# EAGLE design SWD_PROGRAMMER_minimal (EAGLE 7.5.0)
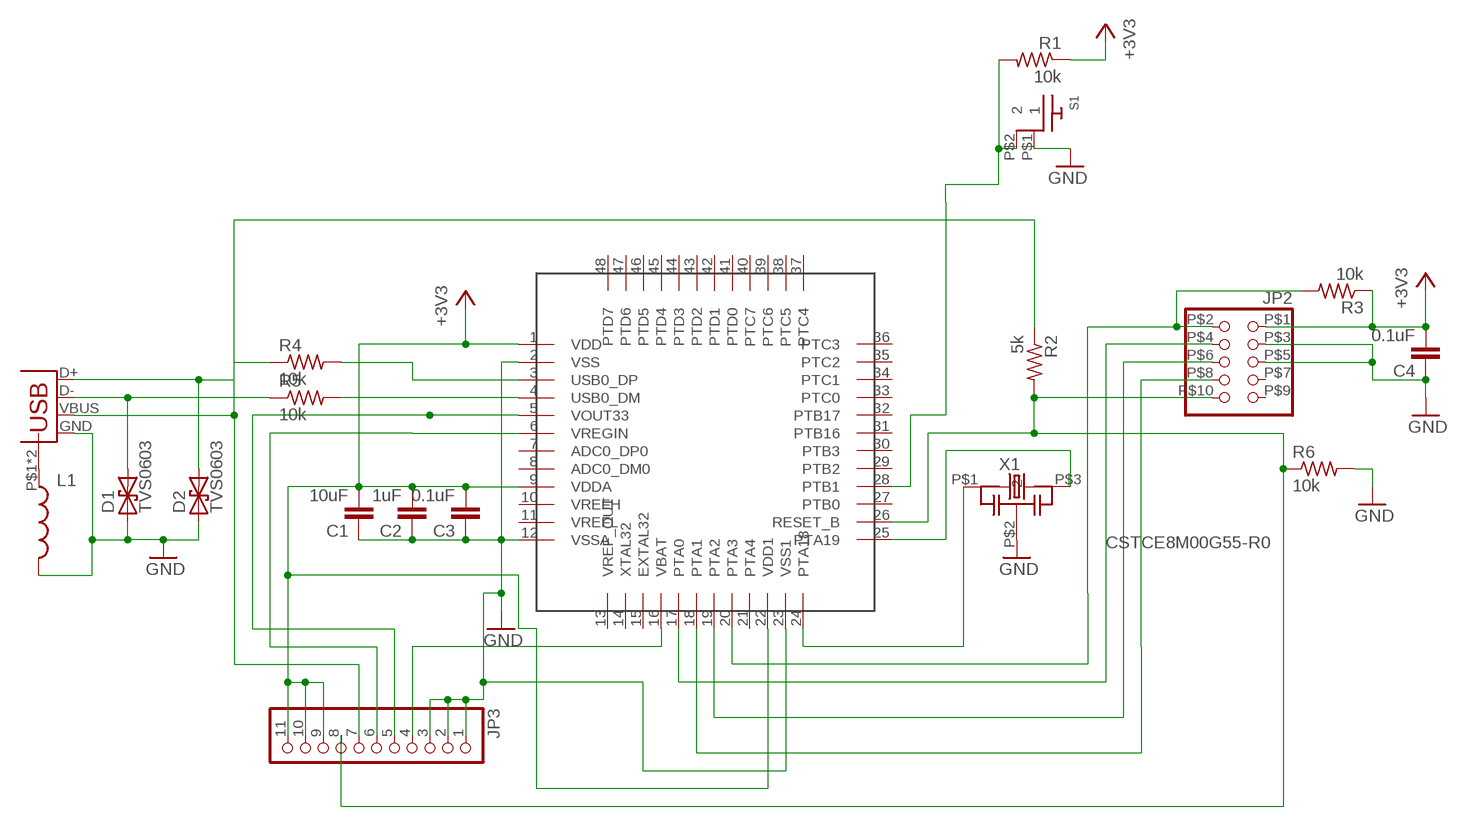
[diagram p0: schematic, sheet 1]

## Parts
C1  10uF  RF-C0805  [C0805]
C2  1uF  RF-C0805  [C0805]
C3  0.1uF  RF-C0805  [C0805]
C4  0.1uF  RF-C0805  [C0805]
D1  TVS0603  [0603-RES]
D2  TVS0603  [0603-RES]
J1  USB_B  [USB-B-PTH-VERTICAL]
JP2  PINHD-2X5SMALL  [2X5HDR]
JP3  PINHD-1X11  [1X11]
L1  INDUCTOR0603  [0603]
R1  10k  RF-R0805  [RF-C0805]
R2  5k  RF-R0805  [RF-C0805]
R3  10k  RF-R0805  [RF-C0805]
R4  10k  RF-R0805  [RF-C0805]
R5  10k  RF-R0805  [RF-C0805]
R6  10k  RF-R0805  [RF-C0805]
S1  RA_BUTTON  [RA_BUTTON]
U$1  KL20_48  [LQFP-48]
X1  CSTCE8M00G55-R0  [CSTCE_G_A]

## Nets
+3V3: C1.2 C2.2 C3.2 C4.2 JP2.P$1 JP3.9 JP3.10 JP3.11 R1.1 R3.1 U$1.1(VDD) U$1.9(VDDA) U$1.22(VDD1)
CLK: JP2.P$4 U$1.17(PTA0)
D_N [USB]: D1.2 J1.D- R5.1
D_P [USB]: D2.2 J1.D+ R4.1
GND [GND]: C1.1 C2.1 C3.1 C4.1 D1.1 D2.1 J1.GND JP2.P$3 JP2.P$5 JP3.1 JP3.2 JP3.3 L1.2 R6.2 S1.P$1 U$1.2(VSS) U$1.12(VSSA) U$1.23(VSS1) X1.P$2
JRST: JP2.P$10 JP3.8 R2.2 R6.1 U$1.26(RESET_B)
N$1: R4.2 U$1.3(USB0_DP)
N$2: J1.VBUS JP3.7 R2.1
N$3: JP3.4 U$1.16(VBAT)
N$4: U$1.24(PTA18) X1.P$1
N$5: J1.P$1(SHIELD) J1.P$2(SHIELD) L1.1
N$6: U$1.25(PTA19) X1.P$3
N$7: JP3.5 U$1.5(VOUT33)
N$8: JP3.6 U$1.6(VREGIN)
N$9: R5.2 U$1.4(USB0_DM)
RST: R1.2 S1.P$2 U$1.28(PTB1)
TDI: JP2.P$8 U$1.18(PTA1)
TDO: JP2.P$6 U$1.19(PTA2)
TMS: JP2.P$2 R3.2 U$1.20(PTA3)
Unconnected: JP2.P$7 JP2.P$9 U$1.7(ADC0_DP0) U$1.8(ADC0_DM0) U$1.10(VREFH) U$1.11(VREFL) U$1.13(VREF_OUT) U$1.14(XTAL32) U$1.15(EXTAL32) U$1.21(PTA4) U$1.27(PTB0) U$1.29(PTB2) U$1.30(PTB3) U$1.31(PTB16) U$1.32(PTB17) U$1.33(PTC0) U$1.34(PTC1) U$1.35(PTC2) U$1.36(PTC3) U$1.37(PTC4) U$1.38(PTC5) U$1.39(PTC6) U$1.40(PTC7) U$1.41(PTD0) U$1.42(PTD1) U$1.43(PTD2) U$1.44(PTD3) U$1.45(PTD4) U$1.46(PTD5) U$1.47(PTD6) U$1.48(PTD7)

## Library data of the parts
C1 = GW-devices:RF-C: RF capacitor pads for FSL reference design; MFGN: Murata; MFGP: GRM219R61E106KA12D
C2 = GW-devices:RF-C: RF capacitor pads for FSL reference design; MFGN: TDK; MFGP: C2012X5R1E105K125AA
C3 C4 = GW-devices:RF-C: RF capacitor pads for FSL reference design; MFGN: TDK; MFGP: C2012X5R1H104K085AA
D1 D2 = SparkFun:TVS; MFGN: Eaton Bussman; MFGP: 0603ESDA2-TR2
J1 = KW2:USB_B; MFGN: Harwin; MFGP: M701-330442
JP2 = KW2:PINHD-2X5: PIN HEADER; MFGN: Sullins Connector Solutions; MFGP: GRPB052VWVN-RC
JP3 = pinhead:PINHD-1X11: PIN HEADER
L1 = SparkFun:INDUCTOR: Inductors Basic Inductor/Choke - 0603 and 1206. Footprints are not proven and vary greatly between part numbers.; MFGN: TDK; MFGP: MPZ1608S331ATA00
R1-R6 = GW-devices:RF-R: RF resistor pads for FSL reference design; MFGN: Vishay Dale; MFGP: CRCW080510K0FKEA
S1 = KW2:RA_BUTTON
U$1 = KW2:KL20_48
X1 = KW2:CSTCE8M00G55-R0

## Net classes
1 USB: width 0.6 mm, clearance 0.2 mm

## Board
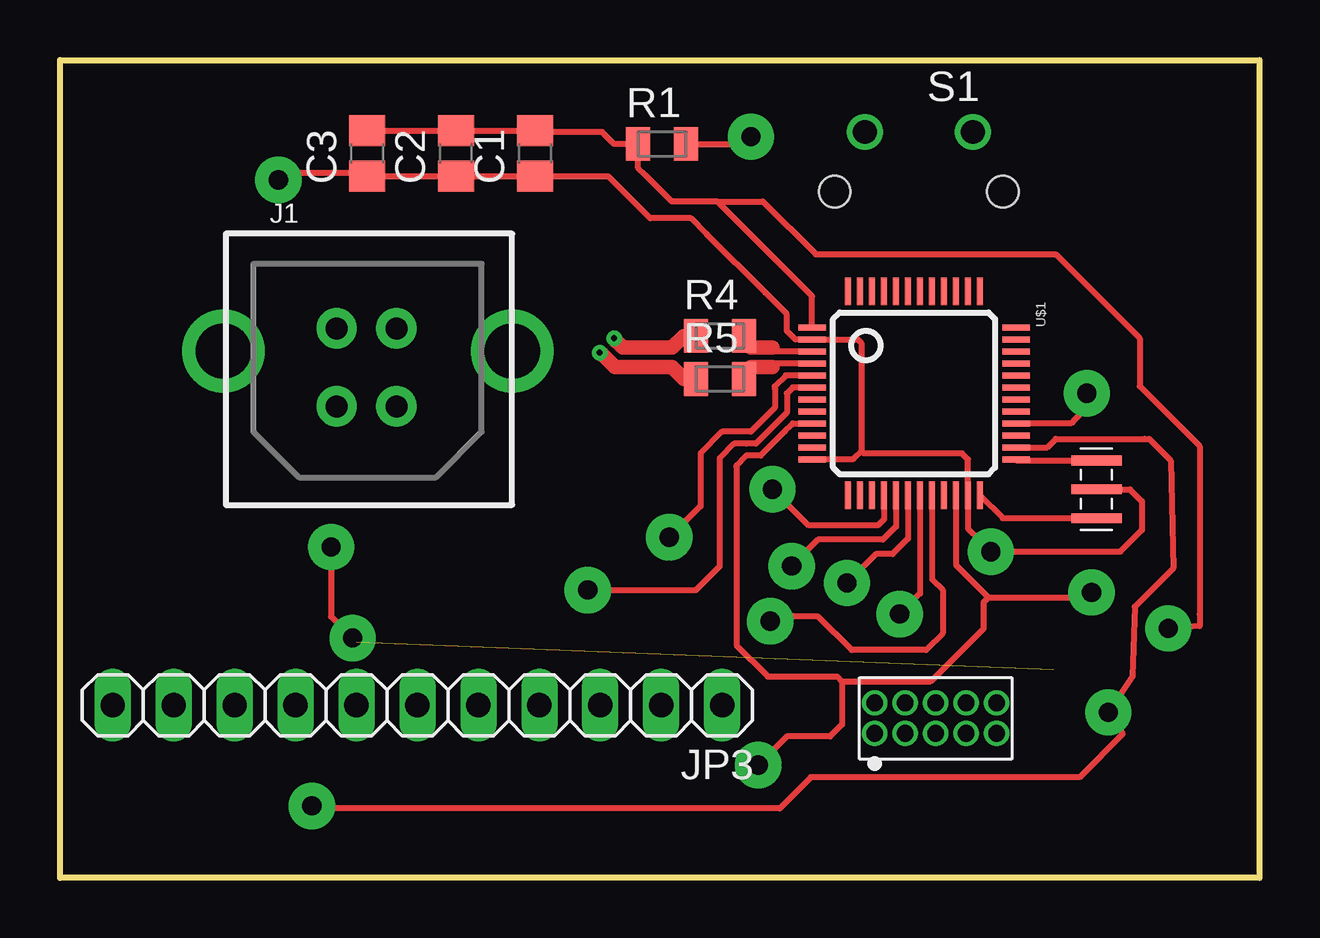
[diagram p1: board, top side]
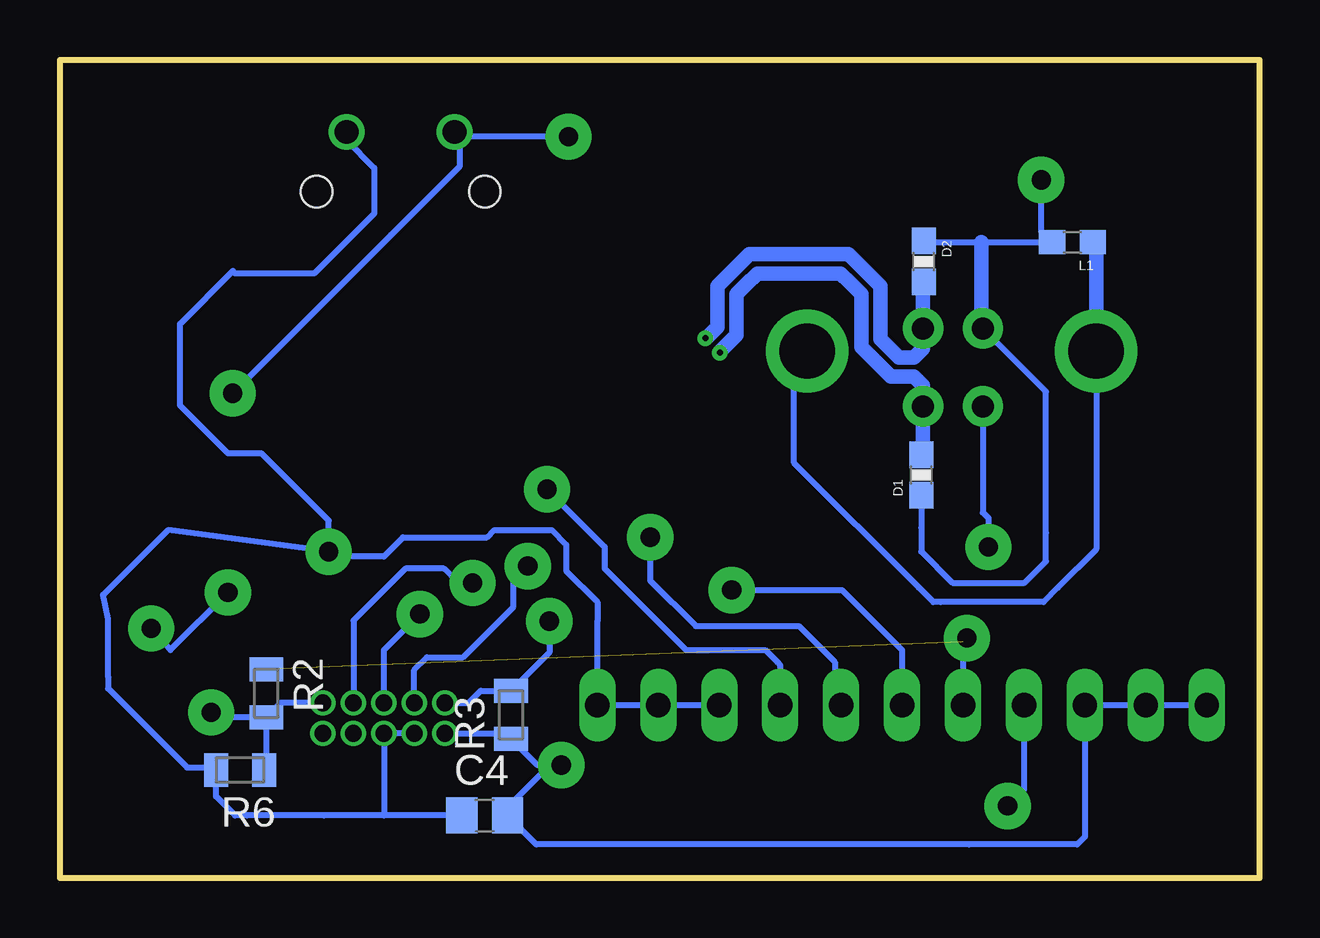
[diagram p2: board, bottom side, seen from below]

Size 50 x 34.1 mm. Coordinates in mm from the lower left corner, seen from the top.
Outline: 0,34.1 50,34.1 50,8.5 50,0 0,0 0,34.1
Copper layers (1*16): Top 0.035559375mm / dielectric 1.47mm / Bottom 0.035559375mm
Design rules "Codeshelf_Advanced": minimum track width 0.2mm, minimum drill 0.25mm, track to track 0.2mm, track to pad 0.2mm, pad to pad 0.2mm, via to via 0.2mm, smd to smd 0mil, copper to edge 0.4mm, drill to drill 0.5mm, minimum pad ring 0.15mm, minimum via ring 0.2mm, stop-mask expansion 0.05mm, vias tented up to drill 0.5mm, thermal gap 0.25mm

### Footprints (pad centres in the part's own frame; a part is rotated, then mirrored left to right if it is on the bottom)
C0805 = smd 1.3 x 1.5: 1 -0.95,0; 2 0.95,0
0603-RES = smd 1.1 x 1: 1 -0.85,0; 2 0.85,0
USB-B-PTH-VERTICAL = drill 0.92 pad 1.676: D+ 4.826,3.95; D- 4.826,7.2; GND 7.315,3.95; VBUS 7.315,7.2 | drill 2.3: P$1 0,4.9; P$2 12.04,4.9
2X5HDR = drill 0.7 pad 1: P$1 -2.54,-0.67; P$2 -2.54,0.6; P$3 -1.27,-0.67; P$4 -1.27,0.6; P$5 0,-0.67; P$6 0,0.6; P$7 1.27,-0.67; P$8 1.27,0.6; P$9 2.54,-0.67; P$10 2.54,0.6
1X11 = drill 1.016 long: 1 -12.7,0; 2 -10.16,0; 3 -7.62,0; 4 -5.08,0; 5 -2.54,0; 6 0,0; 7 2.54,0; 8 5.08,0; 9 7.62,0; 10 10.16,0; 11 12.7,0
0603 = smd 1.1 x 1: 1 -0.85,0; 2 0.85,0
RF-C0805 = smd 1 x 1.4: 1 -1,0; 2 1,0
RA_BUTTON = drill 0.99: P$1 -2.25,0; P$2 2.25,0 | hole 1.3: -3.501,2.49; 3.501,2.49
LQFP-48 = smd 0.254 x 1.143: 1 -2.75,-4.25; 2 -2.25,-4.25; 3 -1.75,-4.25; 4 -1.25,-4.25; 5 -0.75,-4.25; 6 -0.25,-4.25; 7 0.25,-4.25; 8 0.75,-4.25; 9 1.25,-4.25; 10 1.75,-4.25; 11 2.25,-4.25; 12 2.75,-4.25; 25 2.75,4.25; 26 2.25,4.25; 27 1.75,4.25; 28 1.25,4.25; 29 0.75,4.25; 30 0.25,4.25; 31 -0.25,4.25; 32 -0.75,4.25; 33 -1.25,4.25; 34 -1.75,4.25; 35 -2.25,4.25; 36 -2.75,4.25 | smd 1.143 x 0.254: 13 4.25,-2.75; 14 4.25,-2.25; 15 4.25,-1.75; 16 4.25,-1.25; 17 4.25,-0.75; 18 4.25,-0.25; 19 4.25,0.25; 20 4.25,0.75; 21 4.25,1.25; 22 4.25,1.75; 23 4.25,2.25; 24 4.25,2.75; 37 -4.25,2.75; 38 -4.25,2.25; 39 -4.25,1.75; 40 -4.25,1.25; 41 -4.25,0.75; 42 -4.25,0.25; 43 -4.25,-0.25; 44 -4.25,-0.75; 45 -4.25,-1.25; 46 -4.25,-1.75; 47 -4.25,-2.25; 48 -4.25,-2.75
CSTCE_G_A = smd 0.4 x 2.1: P$1 -1.2,0; P$2 0,0; P$3 1.2,0

### Placement (x,y rotation side)
C1  19.8,30.2 90 top
C2  16.5,30.2 90 top
C3  12.8,30.2 90 top
C4  32.3,2.6 0 bottom
D1  14.1,16.8 90 bottom
D2  14,25.7 270 bottom
J1  18.85,26.86 180 top
JP2  36.5,6.7 0 top
JP3  14.9,7.2 180 top
L1  7.8,26.5 180 bottom
R1  25.1,30.6 0 top
R2  41.4,7.7 270 bottom
R3  31.2,6.8 90 bottom
R4  27.5,22.6 0 top
R5  27.5,20.8 0 top
R6  42.5,4.5 180 bottom
S1  35.8,31.1 180 top
U$1  35.6,20.2 270 top
X1  43.2,16.2 90 top

### Tracks (layer width: path | path; a pad name or v marks a point on that pad's centre or on a via)
+3V3  (via drill 0.8 pad 1.93)
  Top 0.254: C3.2 C2.2 C1.2 19.85,31.1 22.6,31.1 23.1,30.6 R1.1 24.1,29.6 24.4,29.3 25.5,28.2 27.4,28.2 | U$1.22 37.35,13.05 38.7,11.7 | 38.7,11.7 42.7,11.7 42.8,11.7 v43,11.9 | U$1.1 31.35,24.25 27.4,28.2 | 32.6,8.2 32.4,8.4 29.5,8.4 28.2,9.7 28.2,17.1 28.2,17.2 28.6,17.6 29.2,17.6 30.2,18.6 30.5,18.9 30.55,18.95 U$1.9 | 32.6,8.2 36.3,8.2 38.5,10.4 38.5,11.5 38.7,11.7 | 32.6,8.2 32.6,6.4 32.1,5.9 30.3,5.9 v29.1,4.7 | 27.4,28.2 29.3,28.2 31.5,26 41.5,26 45,22.5 45,20.5 47.5,18 47.5,11 47.5,10.5 v46.2,10.4
  Bottom 0.254: JP3.11 JP3.10 JP3.9 7.28,1.72 7.6,1.4 12.1,1.4 30.15,1.4 C4.2 31.35,2.95 29.6,4.7 | JP2.P$1 31.83,6.03 31.7,5.9 31.3,5.9 R3.1 30.1,4.7 29.6,4.7 | v29.1,4.7 29.6,4.7 | v43,11.9 45.4,9.5 v46.2,10.4
CLK  (via drill 0.8 pad 1.93)
  Top 0.254: U$1.17 34.85,14.65 34.3,14.1 31.6,14.1 v30.5,13
  Bottom 0.254: JP2.P$4 35.23,8.67 34.7,9.2 33.2,9.2 31.1,11.3 31.1,12.4 v30.5,13
D_N  (via drill 0.25)
  Top 0.6: v22.5,21.9 22.52,21.92 23.13,21.3 24.3,21.3 25.5,21.3 26,20.8 R5.1
  Bottom 0.6: v22.5,21.9 22.52,21.92 21.8,22.63 21.8,23.2 21.8,24.33 21.42,24.72 20.93,25.2 18.1,25.2 17.47,25.2 17.08,24.82 16.6,24.33 16.6,23.9 16.6,22.13 15.98,21.52 15.37,20.9 14.8,20.9 14.4,20.9 14.02,20.52 J1.D- 14.02,17.73 D1.2
D_P  (via drill 0.25)
  Top 0.6: v23.1,22.5 23.08,22.48 23.47,22.1 24.3,22.1 25.5,22.1 26,22.6 R4.1
  Bottom 0.6: v23.1,22.5 23.08,22.48 22.6,22.97 22.6,23.2 22.6,24.67 21.98,25.28 21.27,26 18.1,26 17.13,26 16.52,25.38 15.8,24.67 15.8,23.9 15.8,22.47 15.42,22.08 15.03,21.7 14.8,21.7 14.4,21.7 14.02,22.08 J1.D+ 14.02,24.83 D2.2
GND  (via drill 0.8 pad 1.93)
  Top 0.254: 33.4,17.8 33.4,22.3 33.25,22.45 U$1.2 30.65,22.45 30.3,22.8 30.3,23.5 29.4,24.4 26.95,26.85 26.3,27.5 24.6,27.5 22.85,29.25 C1.1 C2.1 C3.1 12.65,29.4 9.4,29.4 v9.1,29.1 | 33.4,17.8 33.1,17.5 33.05,17.45 U$1.12 | 33.4,17.8 33.5,17.7 37.6,17.7 37.85,17.45 U$1.23 37.85,14.55 38.3,14.1 v38.8,13.6 44.2,13.6 45.1,14.5 45.1,15.7 44.6,16.2 X1.P$2
  Bottom 0.254: v38.8,13.6 38.8,14.9 41.6,17.7 43,17.7 45,19.7 45,23.1 42.8,25.3 42.7,25.2 39.4,25.2 36.9,27.7 36.9,29.6 38.05,30.75 S1.P$1 | JP3.3 JP3.2 JP3.1 27.6,10.7 27.6,11.5 28.9,12.8 28.9,13.9 29.5,14.5 31.9,14.5 32.2,14.2 35.7,14.2 36.5,13.4 38.6,13.4 v38.8,13.6 | C4.1 36.5,2.6 | 36.5,2.6 39,2.6 42.2,2.6 42.7,2.6 43.5,3.4 R6.2 43.6,4.6 44.7,4.6 48,7.9 48,8.4 48,10.8 48.2,11.8 45.5,14.5 v38.8,13.6 | JP2.P$3 JP2.P$5 36.5,2.6 | v9.1,29.1 9.1,26.95 L1.2 11.4,26.5 11.6,26.5 13.95,26.5 D2.1 | D1.1 14.1,14.6 14.1,13.6 12.8,12.3 9.8,12.3 9.1,13 8.9,13.2 8.9,14.4 8.9,20.27 J1.GND
  Bottom 0.6: J1.GND 11.6,22.97 11.6,26.5
JRST  (via drill 0.8 pad 1.93)
  Top 0.254: U$1.26 41.15,17.95 41.5,18.3 45.2,18.3 45.4,18.3 46.3,17.4 46.4,12.9 44.8,11.3 44.7,8.4 v43.7,6.9 44.3,6 42.5,4.2 31.3,4.2 30,2.9 10.6,2.9 v10.5,3
  Bottom 0.254: JP3.8 9.82,3.68 v10.5,3 | R2.2 43.4,6.7 44.2,7.5 44.3,7.5 v43.7,6.9 | JP2.P$10 40.8,7.3 R2.2 | R2.2 41.4,4.6 R6.1
N$1
  Top 0.254: 28.8,22.1 28.5,22.4 R4.2 | U$1.3 29.85,21.95 29.7,22.1
  Top 0.6: 28.8,22.1 29.7,22.1
N$2  (via drill 0.8 pad 1.93)  (1 unrouted)
  Top 0.254: v11.3,13.8 11.3,10.9 v12.2,10
  Bottom 0.254: J1.VBUS 11.54,15.23 11.3,15 v11.3,13.8 | v12.2,10 12.36,9.84 JP3.7
N$3  (via drill 0.8 pad 1.93)
  Top 0.254: U$1.16 34.35,14.95 34.1,14.7 31.2,14.7 v29.7,16.2
  Bottom 0.254: JP3.4 19.98,8.88 20.1,9 20.6,9.5 23.9,9.5 26.8,12.4 27.3,12.9 27.3,13.8 v29.7,16.2
N$4
  Top 0.254: U$1.24 39.3,15 X1.P$1
N$5
  Bottom 0.254: J1.P$2 6.81,13.69 8.4,12.1 9,11.5 13.3,11.5 13.6,11.5 14.2,12.1 19.4,17.3 19.4,21.41 J1.P$1
  Bottom 0.6: L1.1 6.81,26.36 J1.P$2
N$6
  Top 0.254: U$1.25 39.9,17.4 X1.P$3
N$7  (via drill 0.8 pad 1.93)
  Top 0.254: v25.4,14.2 26.7,15.5 26.7,17.7 27.6,18.6 28.8,18.6 29.8,19.6 29.8,20.4 29.8,20.5 30.25,20.95 U$1.5
  Bottom 0.254: v25.4,14.2 25.4,12.4 23.5,10.5 21.4,10.5 19.2,10.5 18,9.3 17.7,9 17.7,7.46 JP3.5
N$8  (via drill 0.8 pad 1.93)
  Top 0.254: v22,12 26.5,12 27.5,13 27.5,17.5 28.1,18.1 28.6,18.1 29,18.1 30.3,19.4 30.3,20.2 30.55,20.45 U$1.6
  Bottom 0.254: v22,12 17.4,12 15.1,9.7 14.9,9.5 JP3.6
N$9
  Top 0.254: 28.8,21.3 28.5,21 R5.2 | U$1.4 29.85,21.45 29.7,21.3
  Top 0.6: 28.8,21.3 29.7,21.3
RST  (via drill 0.8 pad 1.93)
  Top 0.254: R1.2 28.5,30.6 v28.8,30.9 | v42.8,20.2 42.8,19.6 42.3,19.1 42.15,18.95 U$1.28
  Bottom 0.254: v28.8,30.9 33.35,30.9 | 33.35,30.9 S1.P$2 | 33.35,30.9 33.35,29.65 36.2,26.8 v42.8,20.2
TDI  (via drill 0.8 pad 1.93)
  Top 0.254: U$1.18 35.35,14.15 34.7,13.5 34,13.5 v32.8,12.3
  Bottom 0.254: v32.8,12.3 33.4,12.3 34,12.9 35.6,12.9 37,11.5 37.77,10.73 JP2.P$8
TDO  (via drill 0.8 pad 1.93)
  Top 0.254: U$1.19 35.85,11.85 v35,11
  Bottom 0.254: JP2.P$6 36.5,9.5 v35,11
TMS  (via drill 0.8 pad 1.93)
  Top 0.254: U$1.20 36.35,12.45 36.8,12 36.8,10.2 36.1,9.5 33,9.5 31.6,10.9 29.8,10.9 v29.6,10.7
  Bottom 0.254: v29.6,10.7 29.6,9.4 R3.2 32.46,7.8 32.96,7.3 JP2.P$2